# Altium schematic sheet Interface.SchDoc
size A3
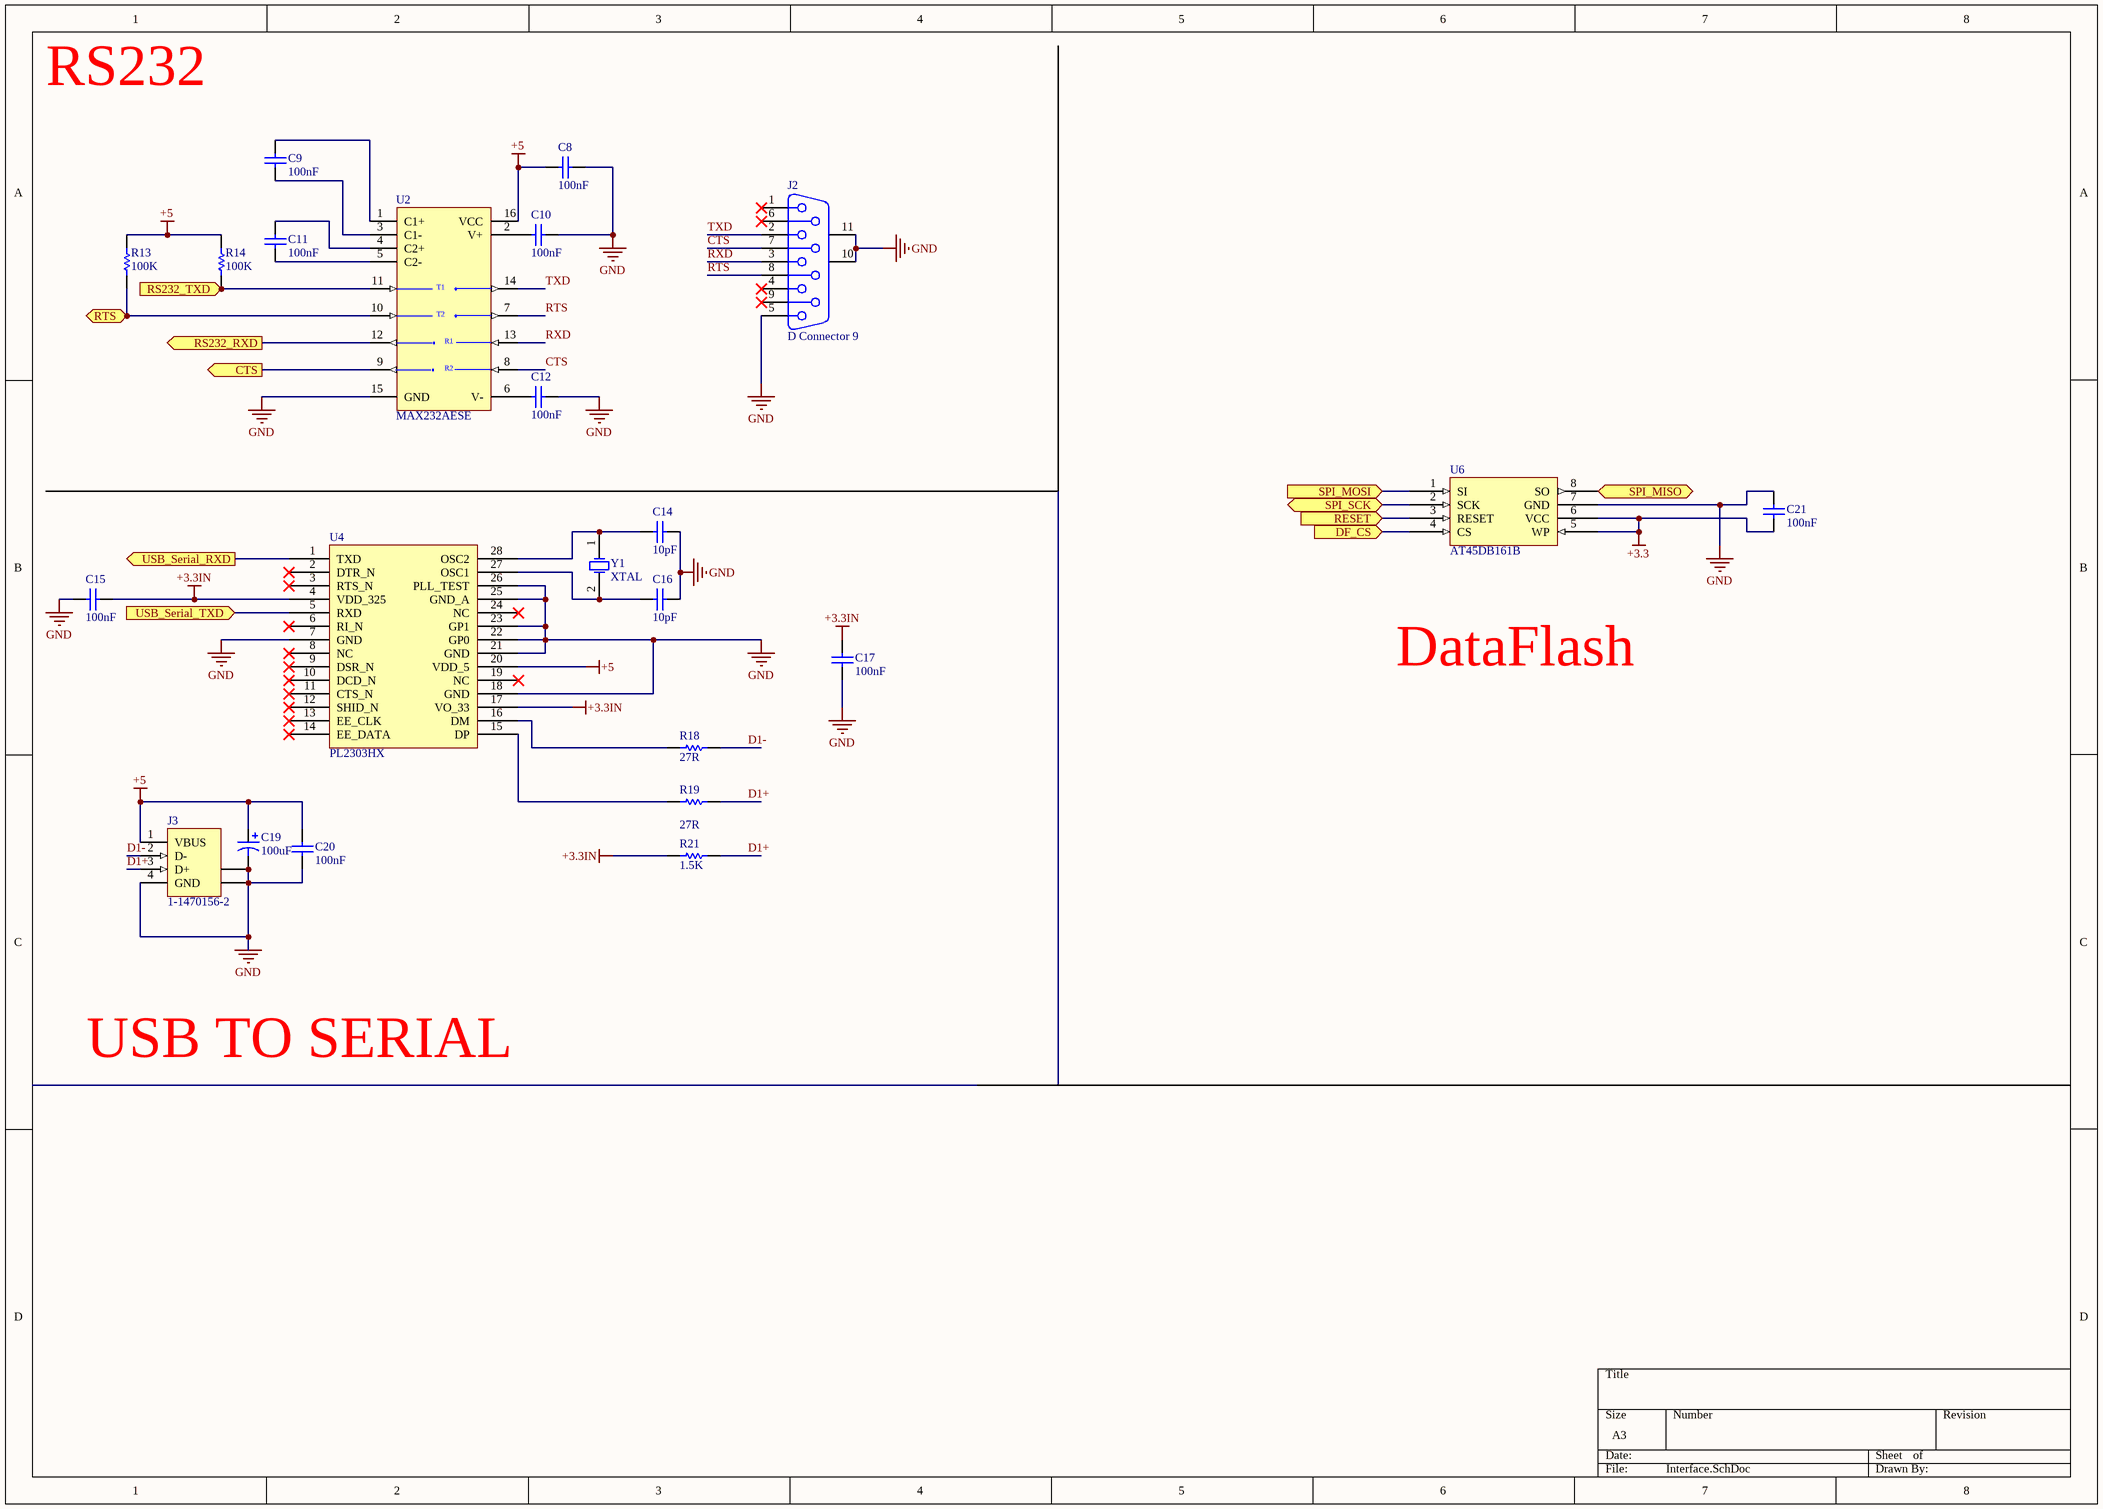
[diagram p0: Interface.SchDoc]

## Parts
C8  100nF  [1206]
C9  100nF  [1206]
C10  100nF  [1206]
C11  100nF  [1206]
C12  100nF  [1206]
C14  10pF  [1206]
C15  100nF  [1206]
C16  10pF  [1206]
C17  100nF  [1206]
C19  100uF  [CAP470]
C20  100nF  [1206]
C21  100nF  [1206]
J2  D Connector 9  [DSUB1.385-2H9]
J3  1-1470156-2  [440247]
R13  100K  [1206]
R14  100K  [1206]
R18  value 27R  [1206]  (hidden comment: 27)
R19  value 27R  [1206]  (hidden comment: 27)
R21  1.5k  [1206]
U2  MAX232AESE  [NSO16_L]
U4  PL2303HX  [SSOP-SS28_M]
U6  AT45DB161B  [SOP8]
Y1  XTAL  [XTAL3]

## Ports
CTS (out), DF_CS (in), RESET (in), RS232_RXD (out), RS232_TXD (in), RTS (in), SPI_MISO (out), SPI_MOSI (in), SPI_SCK (bidir), USB_Serial_RXD (out), USB_Serial_TXD (in)

## Nets
+3.3: C21.1 U6.5(WP) U6.6(VCC)
+3.3IN: C15.2 C17.2 R21.2 U4.4(VDD_325) U4.17(VO_33)
+5: C8.2 C19.1 C20.2 J3.1(VBUS) R13.1 R14.1 U2.16(VCC) U4.20(VDD_5)
GND: C8.1 C10.1 C12.1 C14.1 C15.1 C16.1 C17.1 C19.2 C20.1 C21.2 J2.5 J2.10(MH1) J2.11(MH2) J3.4(GND) J3.5(SHLD) J3.6(SHLD) U2.15(GND) U4.7(GND) U4.18(GND) U4.21(GND) U4.22(GP0) U4.23(GP1) U4.25(GND_A) U4.26(PLL_TEST) U6.7(GND)
CTS: J2.7 U2.8(R2IN)
CTS: U2.9(R2OUT) ; port CTS  [a separate net that carries the same name]
D1+: J3.3(D+) R19.2 R21.1
D1-: J3.2(D-) R18.1
DF_CS: U6.4(CS) ; port DF_CS
RESET: U6.3(RESET) ; port RESET
RS232_RXD: U2.12(R1OUT) ; port RS232_RXD
RS232_TXD: R14.2 U2.11(T1IN) ; port RS232_TXD
RTS: R13.2 U2.10(T2IN) ; port RTS
RTS: J2.8 U2.7(T2OUT)  [a separate net that carries the same name]
RXD: J2.3 U2.13(R1IN)
SPI_MISO: U6.8(SO) ; port SPI_MISO
SPI_MOSI: U6.1(SI) ; port SPI_MOSI
SPI_SCK: U6.2(SCK) ; port SPI_SCK
TXD: J2.2 U2.14(T1OUT)
USB_Serial_RXD: U4.1(TXD) ; port USB_Serial_RXD
USB_Serial_TXD: U4.5(RXD) ; port USB_Serial_TXD
NetC9_1: C9.1 U2.3(C1-)
NetC9_2: C9.2 U2.1(C1+)
NetC10_2: C10.2 U2.2(V+)
NetC11_1: C11.1 U2.5(C2-)
NetC11_2: C11.2 U2.4(C2+)
NetC12_2: C12.2 U2.6(V-)
NetC14_2: C14.2 U4.28(OSC2) Y1.1(OSC1)
NetC16_2: C16.2 U4.27(OSC1) Y1.2(OSC2)
NetR18_2: R18.2 U4.16(DM)
NetR19_1: R19.1 U4.15(DP)

Not connected (* = marked no-connect by the designer): J2 1* 4* 6* 9*; U4 2(DTR_N)* 3(RTS_N)* 6(RI_N)* 8(NC)* 9(DSR_N)* 10(DCD_N)* 11(CTS_N)* 12(SHID_N)* 13(EE_CLK)* 14(EE_DATA)* 19(NC)* 24(NC)*

## Notes on the sheet
- RS232
- DataFlash
- USB TO SERIAL
- (in symbol MAX232AESE) T1; T2; R1; R2

## Library data of the parts
C8-C12 C14-C17 C20 C21 = Cap: Capacitor; Value: 100pF; Published: 8-Jun-2000; LatestRevisionDate: 17-Jul-2002; LatestRevisionNote: Re-released for DXP Platform.; PackageReference: RAD-0.3; Publisher: Altium Limited; PackageDescription: Radial Cap, Thru-Hole; 2 Leads; 0.3 in Pin Spacing
C19 = Cap Pol1: Polarized Capacitor (Radial); Published: 8-Jun-2000; LatestRevisionDate: 17-Jul-2002; LatestRevisionNote: Re-released for DXP Platform.; PackageReference: RB7.6-15; Publisher: Altium Limited; PackageDescription: Polarized Capacitor (Radial); 2 Leads; Value: 100uF
J2 = D Connector 9: Receptacle Assembly, 9 Position, Right Angle; PackageDocument: O; Positions: 9; Published: 15-Jun-2001; LatestRevisionDate: 17-Jul-2002; LatestRevisionNote: Re-released for DXP Platform.; DatasheetDocument: 1-Sep-1999; PackageReference: 788750; Publisher: Altium Limited; Orientation: Right Angle; Gender: Receptacle
J3 = 1-1470156-2: USB 1.1, Right Angle, Thru-Hole, B Type, Receptacle, 4 Position, Black; ContactMaterial: Phosphor Bronze; ContactPlating: Gold over Nickel; TerminationLength: 3.00mm [0.118in.]; PCB_Layout: Complies with manufacturer's recommendation.; DrillSize: Corresponds to nominal value.; PanelGround: Without; Published: 15-Jul-2004; DatasheetDocument: 02-Jun-2001; PackageDocument: 02-Jun-2001; PackageReference: 1-1470156; Publisher: Altium Limited; HousingMaterial: Glass-Filled Thermoplastic; ComponentLink1Description: Manufacturer Link; ComponentLink1URL: http://www.tycoelectronics.com/; ComponentLink2Description: Packaging Specification; ComponentLink2URL: http://ecommas.tycoelectronics.com/commerce/DocumentDelivery/DDEController?Action=showdoc&DocId=Customer+Drawing%7F1470156%7FO%7Ftif%7FEnglish%7FC_1470156_O.tif
R13 R14 = Res1: Resistor; Value: 1K; Published: 8-Jun-2000; Revision: July-2002: Re-released for DXP Platform.; Publisher: Altium Limited
R18 R19 R21 = Res1: Resistor; Published: 8-Jun-2000; LatestRevisionDate: 17-Jul-2002; LatestRevisionNote: Re-released for DXP Platform.; PackageReference: AXIAL-0.3; Publisher: Altium Limited
  R21: Value: 1.5K
U2 = MAX232AESE: +5V-Powered, Multichannel RS-232 Driver/Receiver; Published: 16-Jan-2001; LatestRevisionDate: 13-Apr-2006; LatestRevisionNote: IPC-7351 Footprint Added.; DatasheetVersion: Nov-1997; PackageReference: NSO16; Publisher: Altium Limited; PackageDescription: 16-Pin Small Outline Integrated Circuit 1.27 mm Pitch; Code_JEDEC: MS-012-AC; Code_IPC: SOIC127P600-16; ComponentLink1Description: Manufacturer Link; ComponentLink1URL: http://www.maxim-ic.com/; ComponentLink2Description: Datasheet; ComponentLink2URL: http://pdfserv.maxim-ic.com/en/ds/MAX220-MAX249.pdf
U4 = PL2303
Y1 = XTAL: Crystal Oscillator; Published: 8-Jun-2000; LatestRevisionDate: 17-Jul-2002; LatestRevisionNote: Re-released for DXP Platform.; PackageReference: R38; Publisher: Altium Limited; PackageDescription: Crystal, Thru-Hole; 2 Leads; Body 3.1 x 8.2 mm (Dia.xH)